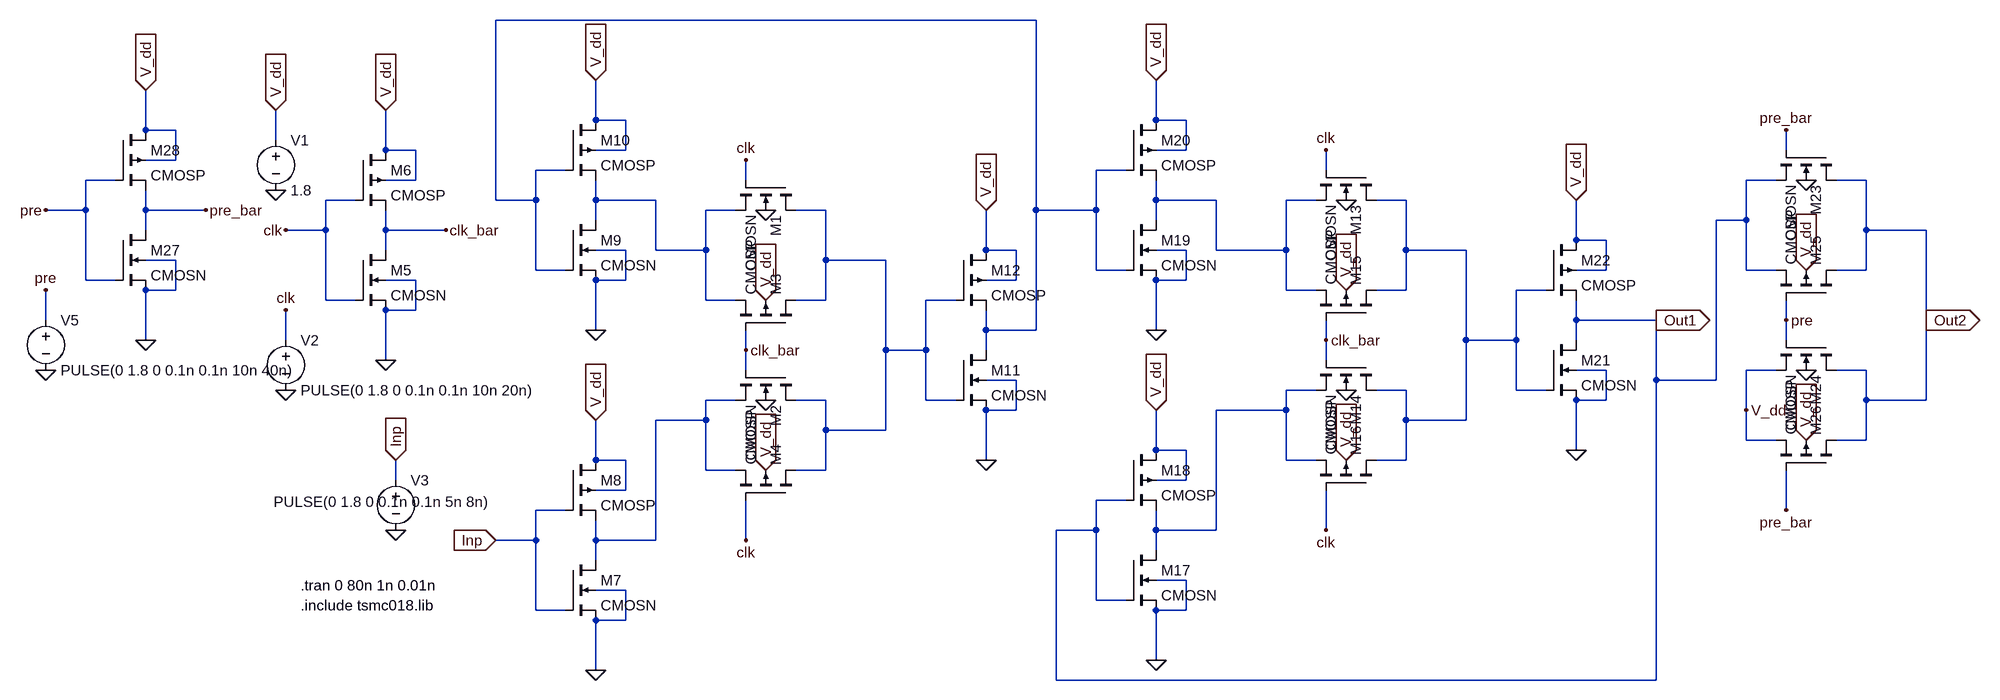
[diagram p0: schematic D-flipflop.asc]
D-flipflop.asc, the LTspice schematic file:
Version 4
SHEET 1 3028 1080
WIRE 832 -48 -32 -48
WIRE 128 112 128 48
WIRE 176 112 128 112
WIRE 1024 112 1024 48
WIRE 1072 112 1024 112
WIRE -592 128 -592 64
WIRE -544 128 -592 128
WIRE -384 144 -384 96
WIRE -208 160 -208 96
WIRE -160 160 -208 160
WIRE 176 160 176 112
WIRE 176 160 128 160
WIRE 1072 160 1072 112
WIRE 1072 160 1024 160
WIRE 2032 160 2032 128
WIRE -544 176 -544 128
WIRE -544 176 -592 176
WIRE 80 192 32 192
WIRE 976 192 928 192
WIRE 1296 192 1296 160
WIRE -640 208 -688 208
WIRE -160 208 -160 160
WIRE -160 208 -208 208
WIRE 368 208 368 176
WIRE 2016 208 1968 208
WIRE 2160 208 2112 208
WIRE -256 240 -304 240
WIRE -32 240 -32 -48
WIRE 32 240 32 192
WIRE 32 240 -32 240
WIRE 128 240 128 208
WIRE 224 240 128 240
WIRE 1024 240 1024 208
WIRE 1120 240 1024 240
WIRE 1280 240 1232 240
WIRE 1424 240 1376 240
WIRE -688 256 -688 208
WIRE -688 256 -752 256
WIRE -592 256 -592 224
WIRE -496 256 -592 256
WIRE 352 256 304 256
WIRE 496 256 448 256
WIRE 832 256 832 -48
WIRE 928 256 928 192
WIRE 928 256 832 256
WIRE 128 272 128 240
WIRE 1024 272 1024 240
WIRE 1968 272 1968 208
WIRE 1968 272 1920 272
WIRE -592 288 -592 256
WIRE -304 288 -304 240
WIRE -304 288 -368 288
WIRE -208 288 -208 256
WIRE -112 288 -208 288
WIRE 2160 288 2160 208
WIRE 2256 288 2160 288
WIRE 1696 304 1696 240
WIRE 1744 304 1696 304
WIRE -208 320 -208 288
WIRE 176 320 128 320
WIRE 224 320 224 240
WIRE 304 320 304 256
WIRE 304 320 224 320
WIRE 752 320 752 256
WIRE 800 320 752 320
WIRE 1072 320 1024 320
WIRE 1120 320 1120 240
WIRE 1232 320 1232 240
WIRE 1232 320 1120 320
WIRE 1424 320 1424 240
WIRE 1520 320 1424 320
WIRE -544 336 -592 336
WIRE 496 336 496 256
WIRE 592 336 496 336
WIRE 32 352 32 240
WIRE 80 352 32 352
WIRE 928 352 928 256
WIRE 976 352 928 352
WIRE 1744 352 1744 304
WIRE 1744 352 1696 352
WIRE 1968 352 1968 272
WIRE 2016 352 1968 352
WIRE 2160 352 2160 288
WIRE 2160 352 2112 352
WIRE -688 368 -688 256
WIRE -640 368 -688 368
WIRE -160 368 -208 368
WIRE 176 368 176 320
WIRE 176 368 128 368
WIRE 800 368 800 320
WIRE 800 368 752 368
WIRE 1072 368 1072 320
WIRE 1072 368 1024 368
WIRE -544 384 -544 336
WIRE -544 384 -592 384
WIRE 1232 384 1232 320
WIRE 1280 384 1232 384
WIRE 1424 384 1424 320
WIRE 1424 384 1376 384
WIRE 1648 384 1600 384
WIRE -304 400 -304 288
WIRE -256 400 -304 400
WIRE 304 400 304 320
WIRE 352 400 304 400
WIRE 496 400 496 336
WIRE 496 400 448 400
WIRE 704 400 656 400
WIRE -160 416 -160 368
WIRE -160 416 -208 416
WIRE -752 432 -752 384
WIRE 1696 432 1696 400
WIRE 1824 432 1696 432
WIRE 2032 432 2032 400
WIRE 2256 432 2256 288
WIRE 128 448 128 368
WIRE 752 448 752 416
WIRE 832 448 832 256
WIRE 832 448 752 448
WIRE 1024 448 1024 368
WIRE -592 464 -592 384
WIRE -368 464 -368 416
WIRE 1296 464 1296 432
WIRE 1520 464 1520 320
WIRE 1600 464 1600 384
WIRE 1600 464 1520 464
WIRE 1696 464 1696 432
WIRE 2032 464 2032 432
WIRE 368 480 368 448
WIRE 592 480 592 336
WIRE 656 480 656 400
WIRE 656 480 592 480
WIRE 752 480 752 448
WIRE -208 496 -208 416
WIRE 1296 496 1296 464
WIRE 368 512 368 480
WIRE 1744 512 1696 512
WIRE 2016 512 1968 512
WIRE 2160 512 2112 512
WIRE 800 528 752 528
WIRE 1824 528 1824 432
WIRE 1920 528 1920 272
WIRE 1920 528 1824 528
WIRE 1280 544 1232 544
WIRE 1424 544 1376 544
WIRE 1600 544 1600 464
WIRE 1648 544 1600 544
WIRE 352 560 304 560
WIRE 496 560 448 560
WIRE 656 560 656 480
WIRE 704 560 656 560
WIRE 1744 560 1744 512
WIRE 1744 560 1696 560
WIRE 2160 560 2160 512
WIRE 2256 560 2256 432
WIRE 2256 560 2160 560
WIRE 800 576 800 528
WIRE 800 576 752 576
WIRE 1232 576 1232 544
WIRE 1232 576 1120 576
WIRE 1968 576 1968 512
WIRE 304 592 304 560
WIRE 304 592 224 592
WIRE 1424 592 1424 544
WIRE 1520 592 1520 464
WIRE 1520 592 1424 592
WIRE 496 608 496 560
WIRE 592 608 592 480
WIRE 592 608 496 608
WIRE 1968 624 1968 576
WIRE 2016 624 1968 624
WIRE 2160 624 2160 560
WIRE 2160 624 2112 624
WIRE 1024 640 1024 576
WIRE 1072 640 1024 640
WIRE 1696 640 1696 560
WIRE 128 656 128 592
WIRE 176 656 128 656
WIRE 752 656 752 576
WIRE 1232 656 1232 576
WIRE 1280 656 1232 656
WIRE 1424 656 1424 592
WIRE 1424 656 1376 656
WIRE 304 672 304 592
WIRE 352 672 304 672
WIRE 496 672 496 608
WIRE 496 672 448 672
WIRE -192 688 -192 656
WIRE 1072 688 1072 640
WIRE 1072 688 1024 688
WIRE 176 704 176 656
WIRE 176 704 128 704
WIRE 976 720 928 720
WIRE 80 736 32 736
WIRE 2032 736 2032 672
WIRE 928 768 928 720
WIRE 928 768 864 768
WIRE 1024 768 1024 736
WIRE 1120 768 1120 576
WIRE 1120 768 1024 768
WIRE 1296 768 1296 704
WIRE 32 784 32 736
WIRE 32 784 -32 784
WIRE 128 784 128 752
WIRE 224 784 224 592
WIRE 224 784 128 784
WIRE 368 784 368 720
WIRE 1024 800 1024 768
WIRE 128 816 128 784
WIRE 1072 848 1024 848
WIRE 176 864 128 864
WIRE 928 880 928 768
WIRE 976 880 928 880
WIRE 32 896 32 784
WIRE 80 896 32 896
WIRE 1072 896 1072 848
WIRE 1072 896 1024 896
WIRE 176 912 176 864
WIRE 176 912 128 912
WIRE 1024 976 1024 896
WIRE 128 992 128 912
WIRE 864 1008 864 768
WIRE 1824 1008 1824 528
WIRE 1824 1008 864 1008
FLAG 368 176 clk
FLAG 368 784 clk
FLAG 368 480 clk_bar
FLAG -384 224 0
FLAG -384 96 V_dd
IOPIN -384 96 In
FLAG -368 544 0
FLAG -368 416 clk
FLAG -208 496 0
FLAG -112 288 clk_bar
FLAG -208 96 V_dd
IOPIN -208 96 In
FLAG -368 288 clk
FLAG 400 256 0
FLAG 400 560 0
FLAG 400 672 V_dd
IOPIN 400 672 In
FLAG 400 400 V_dd
IOPIN 400 400 In
FLAG -192 768 0
FLAG -192 656 Inp
IOPIN -192 656 In
FLAG 128 992 0
FLAG 128 592 V_dd
IOPIN 128 592 In
FLAG 128 448 0
FLAG 128 48 V_dd
IOPIN 128 48 In
FLAG 752 656 0
FLAG 752 256 V_dd
IOPIN 752 256 In
FLAG -32 784 Inp
IOPIN -32 784 In
FLAG 1296 160 clk
FLAG 1296 768 clk
FLAG 1296 464 clk_bar
FLAG 1328 240 0
FLAG 1328 544 0
FLAG 1328 656 V_dd
IOPIN 1328 656 In
FLAG 1328 384 V_dd
IOPIN 1328 384 In
FLAG 1024 976 0
FLAG 1024 576 V_dd
IOPIN 1024 576 In
FLAG 1024 448 0
FLAG 1024 48 V_dd
IOPIN 1024 48 In
FLAG 1696 640 0
FLAG 1696 240 V_dd
IOPIN 1696 240 In
FLAG 1824 432 Out1
IOPIN 1824 432 Out
FLAG 2032 128 pre_bar
FLAG 2032 736 pre_bar
FLAG 2032 432 pre
FLAG 2064 208 0
FLAG 2064 512 0
FLAG 2064 624 V_dd
IOPIN 2064 624 In
FLAG 2064 352 V_dd
IOPIN 2064 352 In
FLAG -752 512 0
FLAG -752 384 pre
FLAG -592 464 0
FLAG -496 256 pre_bar
FLAG -592 64 V_dd
IOPIN -592 64 In
FLAG -752 256 pre
FLAG 1968 576 V_dd
FLAG 2256 432 Out2
IOPIN 2256 432 Out
SYMBOL cmosn 448 208 R90
SYMATTR InstName M1
SYMATTR Value2 l=180n w=1u
SYMBOL cmosn 448 512 R90
SYMATTR InstName M2
SYMATTR Value2 l=180n w=1u
SYMBOL cmosp 448 448 M270
SYMATTR InstName M3
SYMATTR Value2 l=180n w=2u
SYMBOL cmosp 448 720 M270
SYMATTR InstName M4
SYMATTR Value2 l=180n w=2u
SYMBOL voltage -384 128 R0
WINDOW 123 0 0 Left 0
WINDOW 39 0 0 Left 0
SYMATTR InstName V1
SYMATTR Value 1.8
SYMBOL voltage -368 448 R0
WINDOW 123 0 0 Left 0
WINDOW 39 0 0 Left 0
SYMATTR InstName V2
SYMATTR Value PULSE(0 1.8 0 0.1n 0.1n 10n 20n)
SYMBOL cmosn -256 320 R0
SYMATTR InstName M5
SYMATTR Value2 l=180n w=180n
SYMBOL cmosp -256 160 R0
SYMATTR InstName M6
SYMATTR Value2 l=180n w=1080n
SYMBOL voltage -192 672 R0
WINDOW 123 0 0 Left 0
WINDOW 39 0 0 Left 0
WINDOW 3 -195 51 Left 2
SYMATTR Value PULSE(0 1.8 0 0.1n 0.1n 5n 8n)
SYMATTR InstName V3
SYMBOL cmosn 80 816 R0
SYMATTR InstName M7
SYMATTR Value2 l=180n w=180n
SYMBOL cmosp 80 656 R0
SYMATTR InstName M8
SYMATTR Value2 l=180n w=1080n
SYMBOL cmosn 80 272 R0
SYMATTR InstName M9
SYMATTR Value2 l=180n w=180n
SYMBOL cmosp 80 112 R0
SYMATTR InstName M10
SYMATTR Value2 l=180n w=1080n
SYMBOL cmosn 704 480 R0
SYMATTR InstName M11
SYMATTR Value2 l=180n w=180n
SYMBOL cmosp 704 320 R0
SYMATTR InstName M12
SYMATTR Value2 l=180n w=1080n
SYMBOL cmosn 1376 192 R90
SYMATTR InstName M13
SYMATTR Value2 l=180n w=1u
SYMBOL cmosn 1376 496 R90
SYMATTR InstName M14
SYMATTR Value2 l=180n w=1u
SYMBOL cmosp 1376 432 M270
SYMATTR InstName M15
SYMATTR Value2 l=180n w=2u
SYMBOL cmosp 1376 704 M270
SYMATTR InstName M16
SYMATTR Value2 l=180n w=2u
SYMBOL cmosn 976 800 R0
SYMATTR InstName M17
SYMATTR Value2 l=180n w=180n
SYMBOL cmosp 976 640 R0
SYMATTR InstName M18
SYMATTR Value2 l=180n w=1080n
SYMBOL cmosn 976 272 R0
SYMATTR InstName M19
SYMATTR Value2 l=180n w=180n
SYMBOL cmosp 976 112 R0
SYMATTR InstName M20
SYMATTR Value2 l=180n w=1080n
SYMBOL cmosn 1648 464 R0
SYMATTR InstName M21
SYMATTR Value2 l=180n w=180n
SYMBOL cmosp 1648 304 R0
SYMATTR InstName M22
SYMATTR Value2 l=180n w=1080n
SYMBOL cmosn 2112 160 R90
SYMATTR InstName M23
SYMATTR Value2 l=180n w=1u
SYMBOL cmosn 2112 464 R90
SYMATTR InstName M24
SYMATTR Value2 l=180n w=1u
SYMBOL cmosp 2112 400 M270
SYMATTR InstName M25
SYMATTR Value2 l=180n w=2u
SYMBOL cmosp 2112 672 M270
SYMATTR InstName M26
SYMATTR Value2 l=180n w=2u
SYMBOL voltage -752 416 R0
WINDOW 123 0 0 Left 0
WINDOW 39 0 0 Left 0
SYMATTR InstName V5
SYMATTR Value PULSE(0 1.8 0 0.1n 0.1n 10n 40n)
SYMBOL cmosn -640 288 R0
SYMATTR InstName M27
SYMATTR Value2 l=180n w=180n
SYMBOL cmosp -640 128 R0
SYMATTR InstName M28
SYMATTR Value2 l=180n w=1080n
TEXT -344 856 Left 2 !.tran 0 80n 1n 0.01n
TEXT -344 888 Left 2 !.include tsmc018.lib

The netlist it stands for:
* D-flipflop.asc
M1 N005 clk N002 0 CMOSN l=180n w=1u
M2 N005 clk_bar N007 0 CMOSN l=180n w=1u
M3 N005 clk_bar N002 V_dd CMOSP l=180n w=2u
M4 N005 clk N007 V_dd CMOSP l=180n w=2u
V1 V_dd 0 1.8
V2 clk 0 PULSE(0 1.8 0 0.1n 0.1n 10n 20n)
M5 clk_bar clk 0 0 CMOSN l=180n w=180n
M6 V_dd clk clk_bar V_dd CMOSP l=180n w=1080n
V3 Inp 0 PULSE(0 1.8 0 0.1n 0.1n 5n 8n)
M7 N007 Inp 0 0 CMOSN l=180n w=180n
M8 V_dd Inp N007 V_dd CMOSP l=180n w=1080n
M9 N002 N001 0 0 CMOSN l=180n w=180n
M10 V_dd N001 N002 V_dd CMOSP l=180n w=1080n
M11 N001 N005 0 0 CMOSN l=180n w=180n
M12 V_dd N005 N001 V_dd CMOSP l=180n w=1080n
M13 N004 clk N003 0 CMOSN l=180n w=1u
M14 N004 clk_bar N006 0 CMOSN l=180n w=1u
M15 N004 clk_bar N003 V_dd CMOSP l=180n w=2u
M16 N004 clk N006 V_dd CMOSP l=180n w=2u
M17 N006 Out1 0 0 CMOSN l=180n w=180n
M18 V_dd Out1 N006 V_dd CMOSP l=180n w=1080n
M19 N003 N001 0 0 CMOSN l=180n w=180n
M20 V_dd N001 N003 V_dd CMOSP l=180n w=1080n
M21 Out1 N004 0 0 CMOSN l=180n w=180n
M22 V_dd N004 Out1 V_dd CMOSP l=180n w=1080n
M23 Out2 pre_bar Out1 0 CMOSN l=180n w=1u
M24 Out2 pre V_dd 0 CMOSN l=180n w=1u
M25 Out2 pre Out1 V_dd CMOSP l=180n w=2u
M26 Out2 pre_bar V_dd V_dd CMOSP l=180n w=2u
V5 pre 0 PULSE(0 1.8 0 0.1n 0.1n 10n 40n)
M27 pre_bar pre 0 0 CMOSN l=180n w=180n
M28 V_dd pre pre_bar V_dd CMOSP l=180n w=1080n
.model NMOS NMOS
.model PMOS PMOS
.lib standard.mos
.tran 0 80n 1n 0.01n
.include tsmc018.lib
.backanno
.end